# EAGLE design LCDShield (EAGLE 7.3.1)
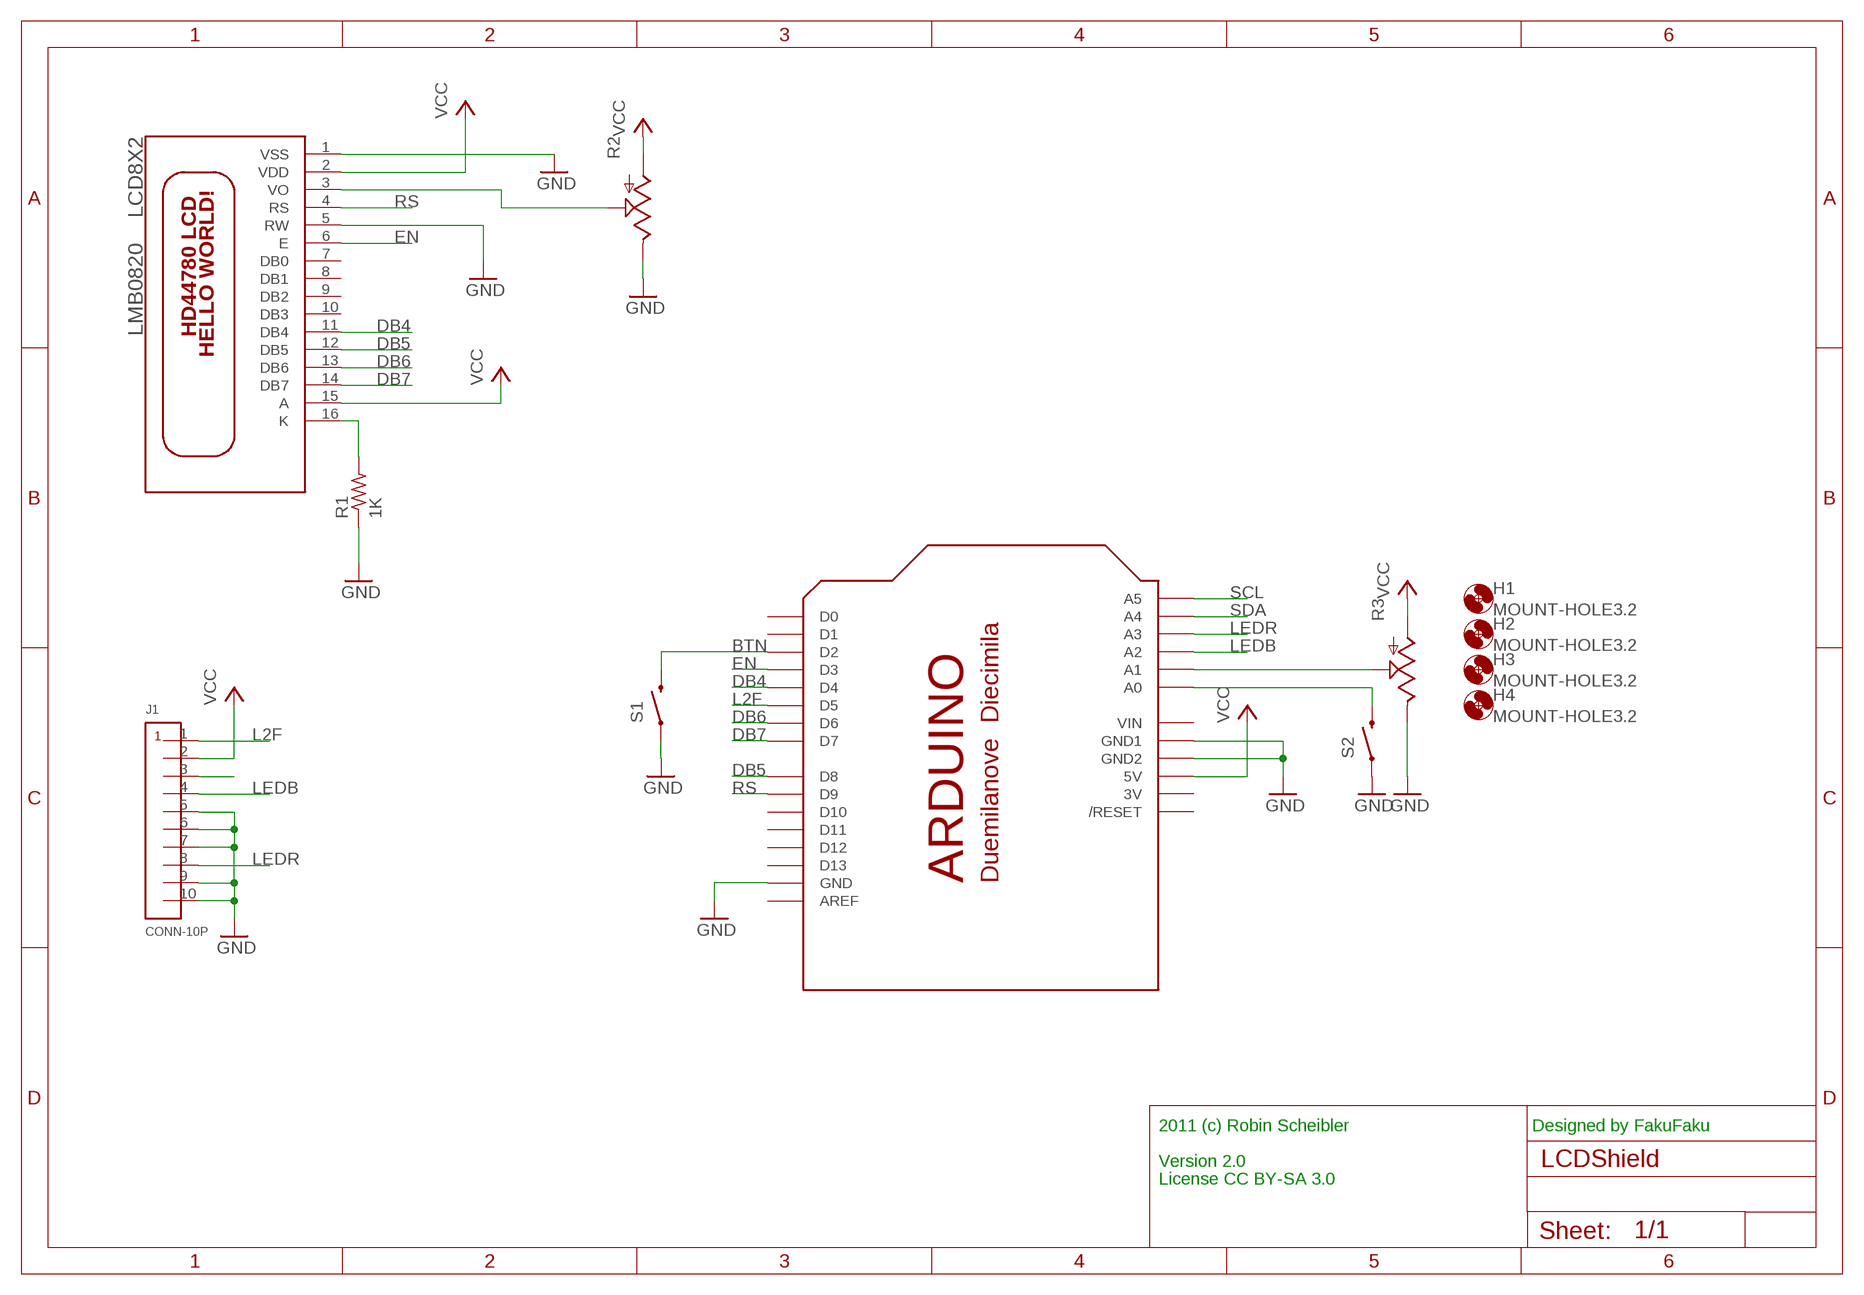
[diagram p0: schematic, sheet 1]

## Parts
H1  MOUNT-HOLE3.2  [3,2]
H2  MOUNT-HOLE3.2  [3,2]
H3  MOUNT-HOLE3.2  [3,2]
H4  MOUNT-HOLE3.2  [3,2]
J1  CONN-10P  [MICROMATCH-10P-SMD]
LCD8X2  LMB0820  [LMB0820]
R1  1K  R-US_0207/10  [0207/10]
R2  POTTRIM  [TRIM_POT]
R3  POT  [ALPS_POT]
S1  SWITCH-MOMENTARY-2PTH  [TACTILE-PTH]
S2  SWITCH-MOMENTARY-2PTH  [TACTILE-PTH]
SHIELD  ARDUINOSHIELD-PINS  [ARDUINO-PINS]

## Nets
BTN: S1.3 SHIELD.D2
CON3: J1.3
DB4: LCD8X2.11(DB4) SHIELD.D4
DB5: LCD8X2.12(DB5) SHIELD.D8
DB6: LCD8X2.13(DB6) SHIELD.D6
DB7: LCD8X2.14(DB7) SHIELD.D7
EN: LCD8X2.6(E) SHIELD.D3
GND: J1.5 J1.6 J1.7 J1.9 J1.10 LCD8X2.1(VSS) LCD8X2.5(RW) R1.1 R2.2(E) R3.P$1(E) S1.1 S2.1 SHIELD.GND SHIELD.GND1 SHIELD.GND2
L2F: J1.1 SHIELD.D5
LEDB: J1.4 SHIELD.A2
LEDR: J1.8 SHIELD.A3
N$2: LCD8X2.16(K) R1.2
N$3: LCD8X2.3(VO) R2.1(S)
N$4: S2.3 SHIELD.A0
N$5: R3.P$2(S) SHIELD.A1
RS: LCD8X2.4(RS) SHIELD.D9
SCL: SHIELD.A5
SDA: SHIELD.A4
VCC: J1.2 LCD8X2.2(VDD) LCD8X2.15(A) R2.3(A) R3.P$3(A) SHIELD.5V
Unconnected: LCD8X2.7(DB0) LCD8X2.8(DB1) LCD8X2.9(DB2) LCD8X2.10(DB3) SHIELD.AREF SHIELD.D0 SHIELD.D1 SHIELD.D10 SHIELD.D11 SHIELD.D12 SHIELD.D13 SHIELD.RESET(/RESET)

## Notes on the sheet
- 2011 (c) Robin Scheibler | Designed by FakuFaku
- Version 2.0
- License CC BY-SA 3.0

## Power pins joined to a net without a drawn wire
3V: SHIELD.3V
VIN: SHIELD.VIN

## Library data of the parts
H1-H4 = holes:MOUNT-HOLE: MOUNTING HOLE with drill center marker
J1 = LCAV:CONN-10P
LCD8X2 = Robin:LMB0820: LMB0820 : LCD Screen from Seeed Studio
R1 = adafruit:R-US_: RESISTOR, American symbol
R2 R3 = SparkFun:POT
S1 S2 = SparkFun:SWITCH-MOMENTARY-2
SHIELD = Robin:ARDUINOSHIELD: Arduino Diecimila/Duemilanove Make a shield with ease, this package has all the named pins as well as the two mounting drill holes and an outline of the USB and DC power connector. The outline is on the DIMENSION layer, so if your board house uses it they will cut the outline to match. http://www.ladyada.net/library/pcb/eaglelibrary.html

## Board
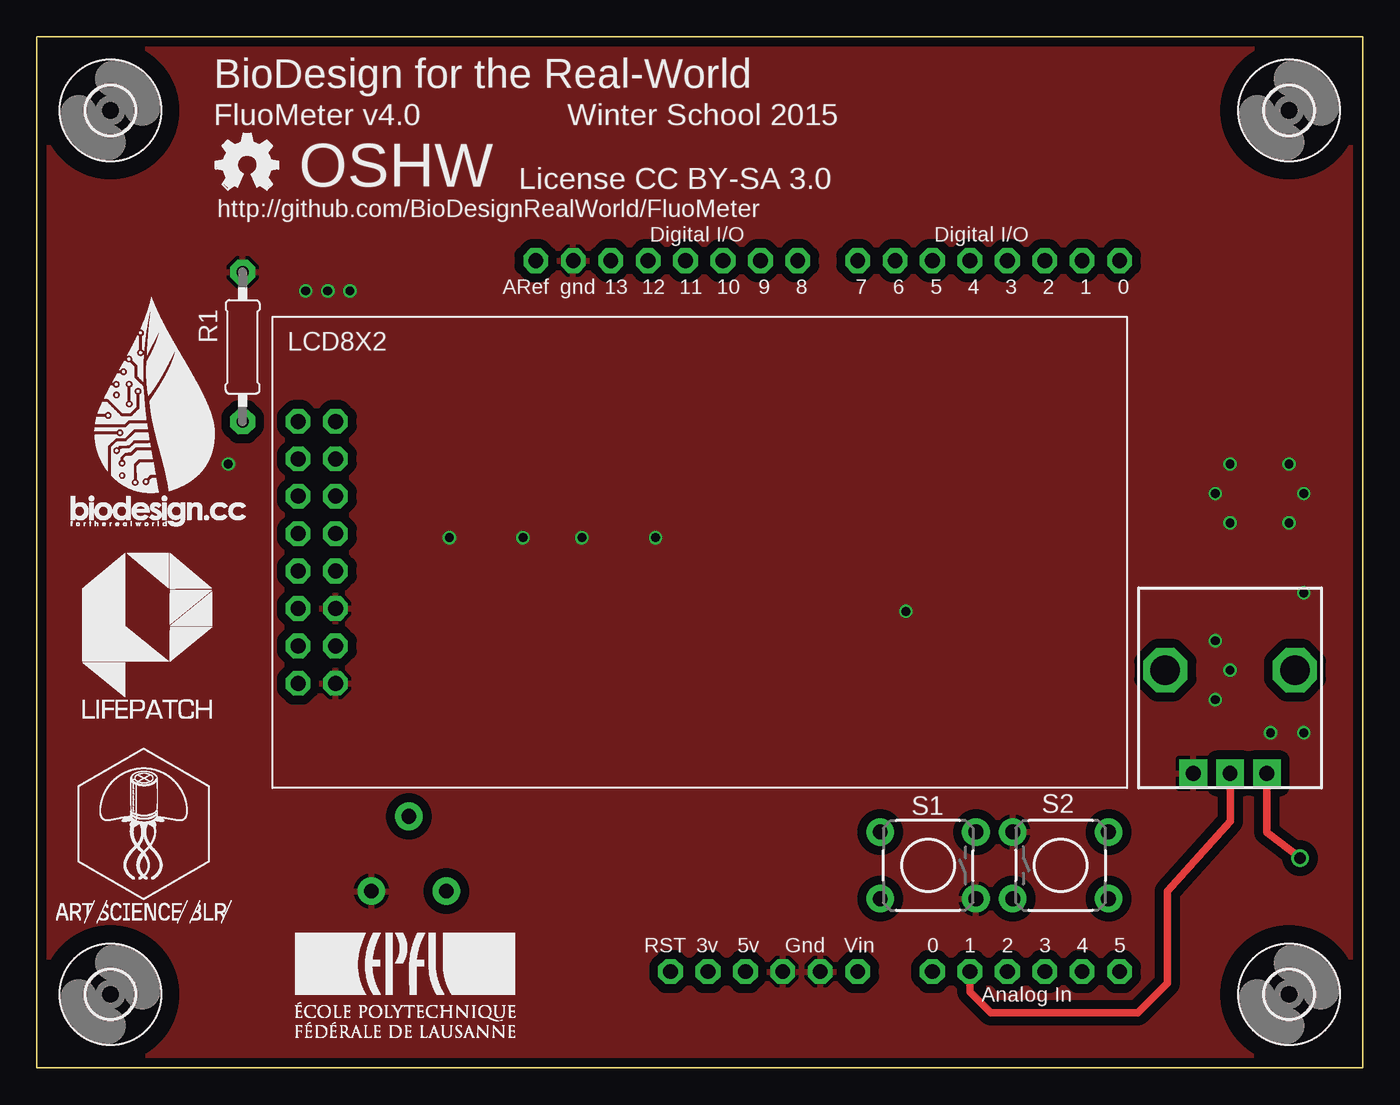
[diagram p1: board, top side]
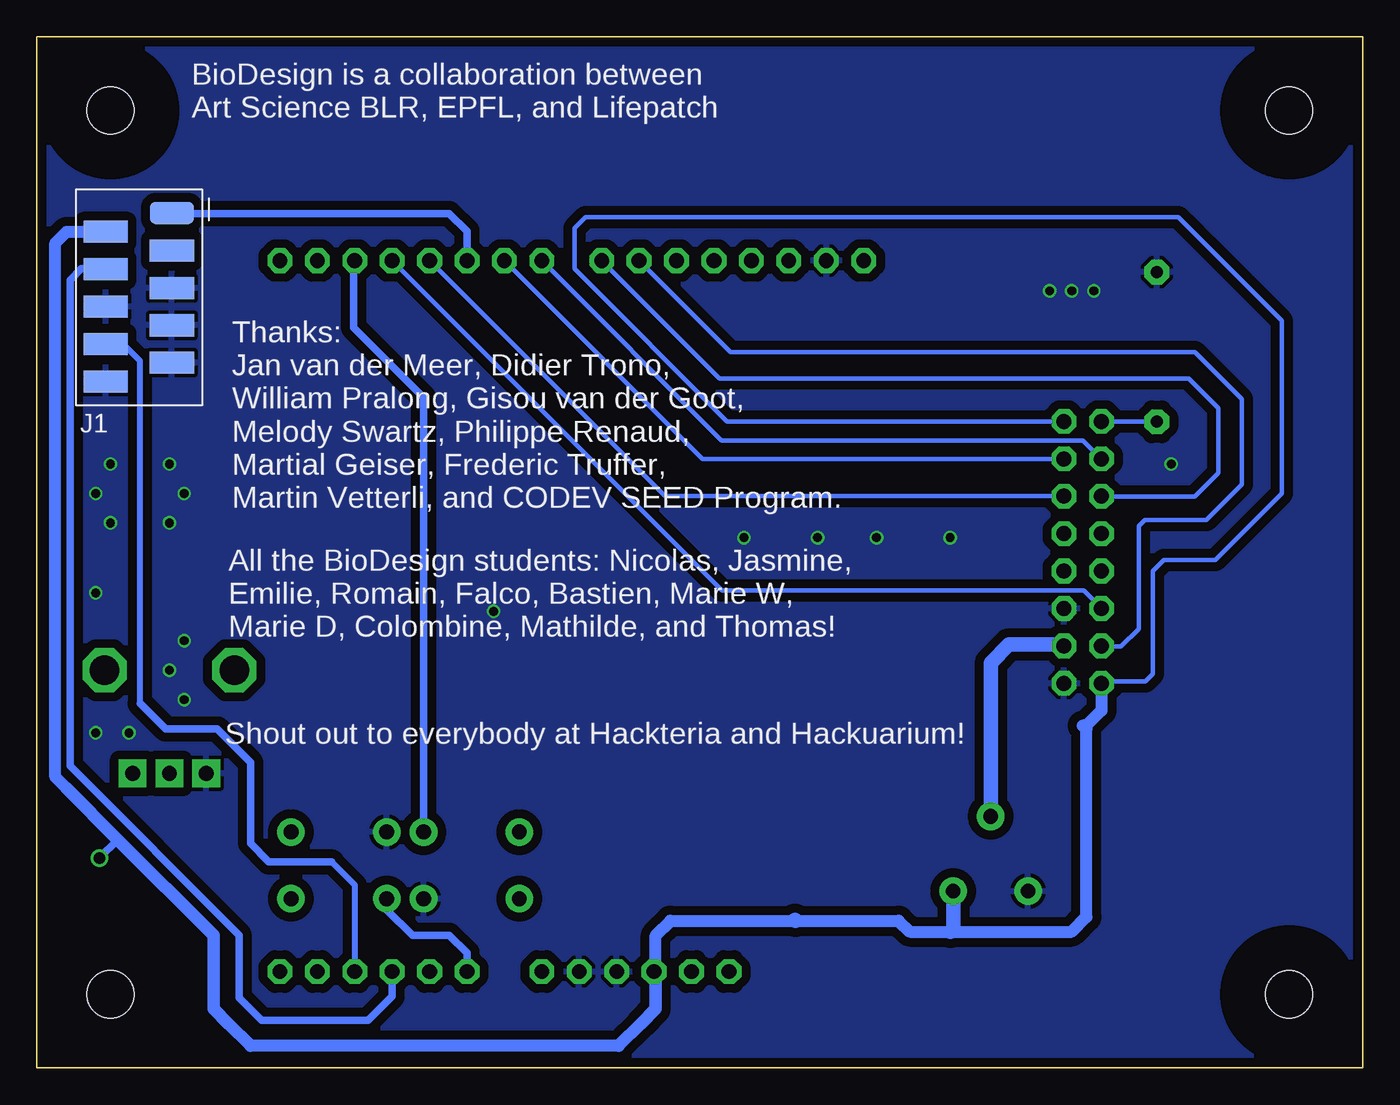
[diagram p2: board, bottom side, seen from below]

Size 90 x 70 mm. Coordinates in mm from the lower left corner, seen from the top.
Outline: 0,0 90,0 90,70 0,70 0,0
Copper layers (1*16): Top 0.035mm / dielectric 1.5mm / Bottom 0.035mm
Design rules "Fusion_eagle_rule_v1.1": minimum track width 6mil, minimum drill 12mil, track to track 6mil, track to pad 6mil, pad to pad 6mil, via to via 6mil, smd to smd 0mil, copper to edge 10mil, drill to drill 10mil, minimum pad ring 10mil, minimum via ring 6mil, stop-mask expansion 2mil, vias tented up to drill 100mil, thermal gap 10mil

### Footprints (pad centres in the part's own frame; a part is rotated, then mirrored left to right if it is on the bottom)
3,2 = hole 3.2: 0,0
MICROMATCH-10P-SMD = smd 1.5 x 3: 1 0,0; 2 1.27,-4.5; 3 2.54,0; 4 3.81,-4.5; 5 5.08,0; 6 6.35,-4.5; 7 7.62,0; 8 8.89,-4.5; 9 10.16,0; 10 11.43,-4.5
LMB0820 = drill 1.016 pad 1.676 octagon: 1 -24.73,-8.89; 2 -27.27,-8.89; 3 -24.73,-6.35; 4 -27.27,-6.35; 5 -24.73,-3.81; 6 -27.27,-3.81; 7 -24.73,-1.27; 8 -27.27,-1.27; 9 -24.73,1.27; 10 -27.27,1.27; 11 -24.73,3.81; 12 -27.27,3.81; 13 -24.73,6.35; 14 -27.27,6.35; 15 -24.73,8.89; 16 -27.27,8.89
0207/10 = drill 0.813 pad 1.676 octagon: 1 -5.08,0; 2 5.08,0
TRIM_POT = drill 1 pad 1.88: 1 5.08,0; 2 0,2.54; 3 0,-2.54
ALPS_POT = drill 1 pad 1.88 square: P$1 7,-2.5; P$2 7,0; P$3 7,2.5 | drill 2 octagon: P$4 0,-4.4; P$5 0,4.4
TACTILE-PTH = drill 1.016 pad 1.88: 1 -3.251,2.261; 2 3.251,2.261; 3 -3.251,-2.261; 4 3.251,-2.261
ARDUINO-PINS = drill 1 pad 1.676 octagon: 3V 35.56,2.54; 5V 38.1,2.54; A0 50.8,2.54; A1 53.34,2.54; A2 55.88,2.54; A3 58.42,2.54; A4 60.96,2.54; A5 63.5,2.54; AREF 23.876,50.8; D0 63.5,50.8; D1 60.96,50.8; D2 58.42,50.8; D3 55.88,50.8; D4 53.34,50.8; D5 50.8,50.8; D6 48.26,50.8; D7 45.72,50.8; D8 41.656,50.8; D9 39.116,50.8; D10 36.576,50.8; D11 34.036,50.8; D12 31.496,50.8; D13 28.956,50.8; GND 26.416,50.8; GND1 43.18,2.54; GND2 40.64,2.54; RESET 33.02,2.54; VIN 45.72,2.54

### Placement (x,y rotation side)
H1  5,5 0 top
H2  85,5 0 top
H3  5,65 0 top
H4  85,65 0 top
J1  80.83,58.03 270 bottom
LCD8X2  45,35 0 top
R1  13.97,48.95 270 top
R2  25.25,12 90 top
R3  81,27 270 top
S1  60.5,13.75 180 top
S2  69.5,13.75 0 top
SHIELD  10,4 0 top
U$1  [BIODESIGN]  2.25,36.75 0 top
U$4  [OSHW_FILLX150_NOTEXT]  12.15,59.62 0 top
U$5  [LIFEPATCH]  3,23.25 0 top
U$6  [ARTSCIENCEBLR]  1.25,9.75 0 top
U$7  [EPFL_LOGO_15MM]  17.5,2 0 top

### Tracks (layer width: path | path; a pad name or v marks a point on that pad's centre or on a via)
BTN
  Bottom 0.5: S1.3 63.75,45.5 68.5,50.25 68.5,54.72 SHIELD.D2
DB4
  Bottom 0.3: SHIELD.D4 47.35,38.81 LCD8X2.11
DB5
  Bottom 0.3: SHIELD.D8 43.66,46.8 11.8,46.8 9.8,44.8 9.8,40.4 11.4,38.8 LCD8X2.12
DB6
  Bottom 0.3: SHIELD.D6 44.81,41.35 LCD8X2.13
DB7
  Bottom 0.3: SHIELD.D7 43.52,42.6 18.98,42.6 LCD8X2.14
EN
  Bottom 0.3: SHIELD.D3 43.48,32.4 18.94,32.4 LCD8X2.6
GND  (via drill 0.6)
  other vias: 59,31 85,41 86,39 85,37 86,32.25 83.75,22.75 86,22.75 81,41 80,39 81,37 80,29 81,27 80,25 28,36 33,36 37,36 42,36 13,41 18.25,52.75 19.75,52.75 21.25,52.75
  pour Bottom (isolate 0.61): -4.83,-2.54 -4.83,71.66 93.85,71.66 93.85,-2.54
  pour Top (isolate 0.61): -2.79,71.13 -2.79,-1.4 92.36,-1.4 92.36,71.13
L2F
  Bottom 0.5: SHIELD.D5 60.8,56.8 62,58 81,58
  Bottom 0.85: J1.1 80.97,58.03 81,58
LEDB
  Bottom 0.5: SHIELD.A2 65.88,4.87 67.5,3.25 74.75,3.25 76.25,4.75 76.25,9 87.75,20.5 87.75,53.5 87,54.25 85.36,54.25 J1.4
LEDR
  Bottom 0.4: J1.8 84.14,49.14 83,48 83,24.75 | 70,14 68.42,12.42 SHIELD.A3
  Bottom 0.5: 70,14 74.25,14 75.5,15.25 75.5,20.75 77.75,23 81.25,23 83,24.75
N$2
  Bottom 0.3: LCD8X2.16 14.24,43.89 R1.2
N$3
  Bottom 1: R2.1 25.25,27.5 24,28.75 20.37,28.75 LCD8X2.3
N$4
  Bottom 0.5: SHIELD.A0 60.8,7.8 62,9 64.5,9 66.25,10.75 S2.3
N$5
  Top 0.5: SHIELD.A1 63.34,5.16 64.75,3.75 74.75,3.75 76.75,5.75 76.75,12 81,16.75 R3.P$2
RS
  Bottom 0.3: SHIELD.D9 42.92,48.6 11.4,48.6 8.2,45.4 8.2,39.6 10.6,37.2 14.8,37.2 15.2,36.8 15.2,29.8 16.4,28.6 17.68,28.6 LCD8X2.4
VCC  (via drill 0.8)
  Top 0.5: R3.P$3 83.5,16 v85.75,14.25
  Bottom 0.3: LCD8X2.15 43.14,43.89 53.5,54.25 53.5,57 52.75,57.75 12.5,57.75 5.5,50.75 5.5,39 10,34.5 13.5,34.5 14.25,33.75 14.25,26.75 14.75,26.25 17.59,26.25 LCD8X2.2
  Bottom 0.5: v85.75,14.25 84.5,15.5
  Bottom 0.8: LCD8X2.2 17.73,24.27 18.75,23.25 19,23.25 18.75,23 18.75,10.25 19.75,9.25 28,9.25 30.75,9.25 31.5,10 38.5,10 47,10 48,9 48,6.44 | 49,3 50.5,1.5 75.5,1.5 77,3 | 88,19 88.75,19.75 88.75,56 87.99,56.76 J1.2
  Bottom 0.85: 88,19 84.5,15.5 78,9 78,4 77,3 | 49,3 48,4 48,6.44 SHIELD.5V
  Bottom 1: 38.54,10.04 38.5,10 | R2.3 27.79,9.46 28,9.25

### Text on the board
tPlace: BioDesign for the Real-World | FluoMeter v4.0 | Winter School 2015 | OSHW | License CC BY-SA 3.0 | http://github.com/BioDesignRealWorld/FluoMeter
bPlace: BioDesign is a collaboration between / Art Science BLR, EPFL, and Lifepatch | Thanks: / Jan van der Meer, Didier Trono, / William Pralong, Gisou van der Goot, / Melody Swartz, Philippe Renaud, / Martial Geiser, Frederic Truffer, / Martin Vetterli, and CODEV SEED Program. | All the BioDesign students: Nicolas, Jasmine, / Emilie, Romain, Falco, Bastien, Marie W, / Marie D, Colombine, Mathilde, and Thomas! | Shout out to everybody at Hackteria and Hackuarium!